# Altium project STM32G0_Test.PrjPcb
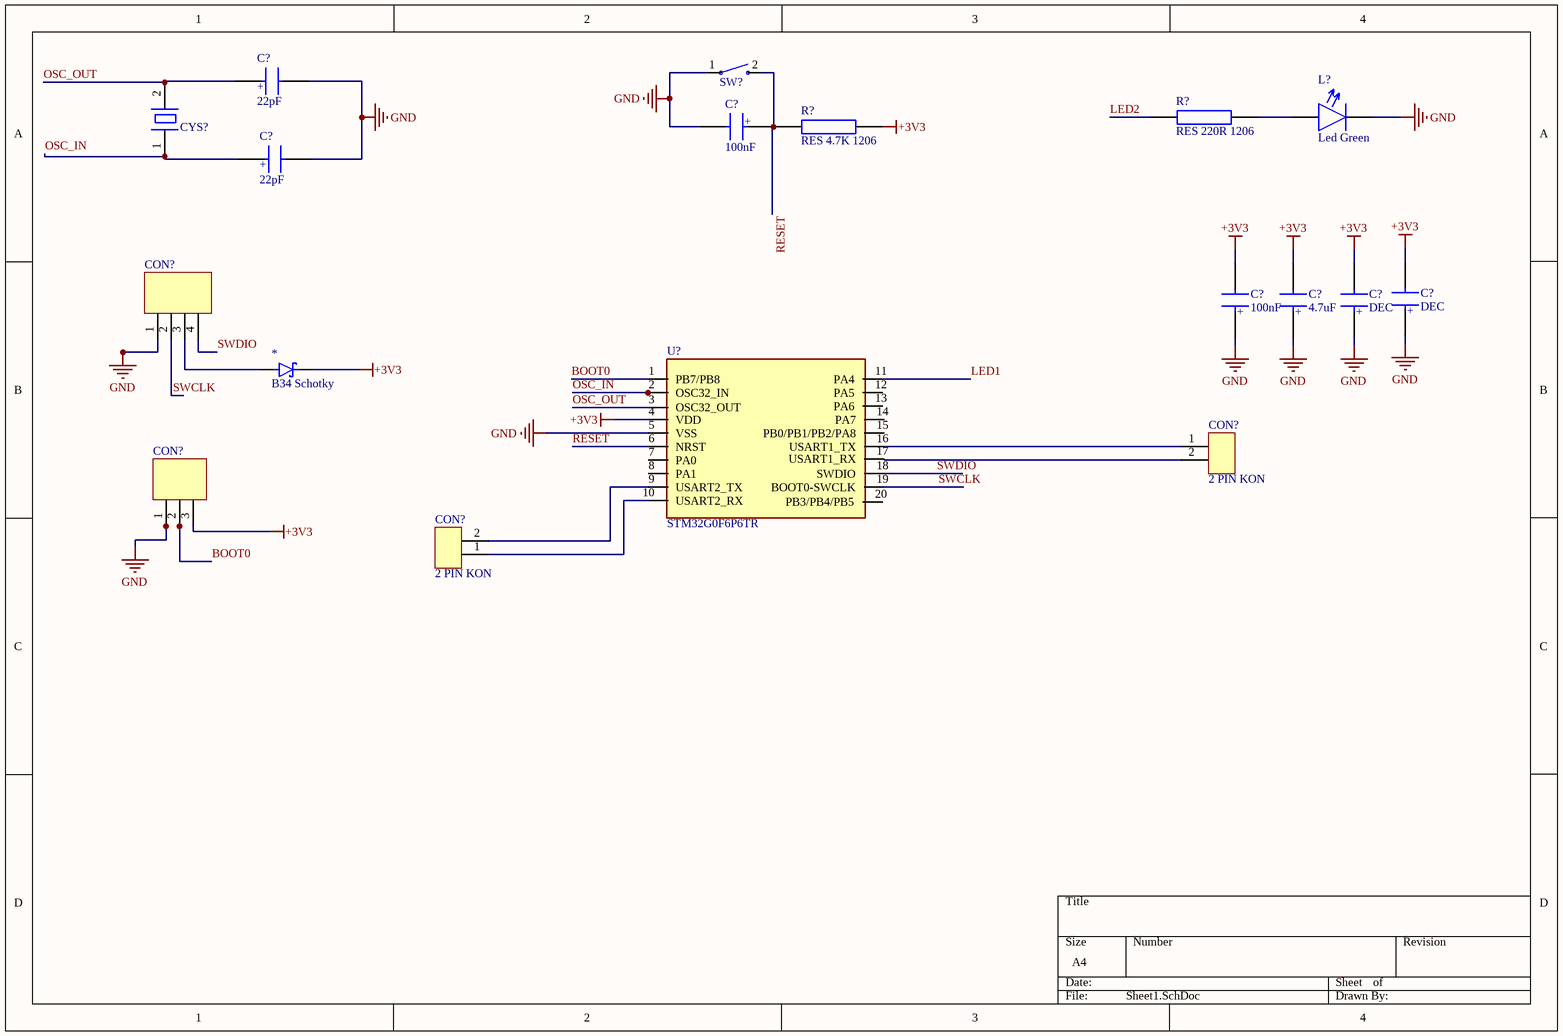
[diagram p0: Sheet1.SchDoc]
1 sheet, 18 parts. Net scope: global (net labels, ports and power ports of the same name join across sheets).
Board file: PCB2.PcbDoc

## Sheet Sheet1.SchDoc
size A4; SheetNumber: 1; SheetTotal: 1

### Parts
(Parts that share a designator on the sheet are numbered #1, #2 ... from top to bottom, then left to right.)
*  B34 Schotky  [DIOM5226X240N]
C?#1  22pF  [CAP_805]
C?#2  100nF  [CAP_805]
C?#3  22pF  [CAP_805]
C?#4  DEC  [CAP_805]
C?#5  100nF  [CAP_805]
C?#6  4.7uF  [CAP_805]
C?#7  DEC  [CAP_805]
CON?#1  4 PIN CON  [4 PIN 2.54MM]  (value not drawn)
CON?#2  2 PIN KON  [2 PIN 2.54MM]
CON?#3  3 PIN KON  [3pin 2.54mm]  (value not drawn)
CON?#4  2 PIN KON  [2 PIN 2.54MM]
CYS?  Kristal - HC-49Us  [Kristal - HC-49Us -smd]  (value not drawn)
L?  Led Green  [Led 1206]
R?#1  RES 220R 1206  [RES_1206]
R?#2  RES 4.7K 1206  [RES_1206]
SW?  1437566-3  [SW_1437566-3]  (value not drawn)
U?  STM32G0F6P6TR  [TSSOP-20]

### Nets
+3V3: *.C C?#4.2 C?#5.2 C?#6.2 C?#7.2 CON?#3.3 R?#2.2 U?.4(VDD)
GND: C?#1.2 C?#2.2 C?#3.2 C?#4.1 C?#5.1 C?#6.1 C?#7.1 CON?#1.1 CON?#3.1 L?.2 SW?.1 U?.5(VSS)
BOOT0: CON?#3.2 U?.1(PB7/PB8)
LED1: U?.11(PA4)
LED2: R?#1.1
OSC_IN: C?#3.1 CYS?.1 U?.2(OSC32_IN)
OSC_OUT: C?#1.1 CYS?.2 U?.3(OSC32_OUT)
RESET: C?#2.1 R?#2.1 SW?.2 U?.6(NRST)
SWCLK: CON?#1.2 U?.19(BOOT0-SWCLK)
SWDIO: CON?#1.4 U?.18(SWDIO)
Net*_A: *.A CON?#1.3
NetCON?#2_1: CON?#2.1 U?.16(USART1_TX)
NetCON?#2_2: CON?#2.2 U?.17(USART1_RX)
NetCON?#4_1: CON?#4.1 U?.10(USART2_RX)
NetCON?#4_2: CON?#4.2 U?.9(USART2_TX)
NetL?_1: L?.1 R?#1.2

Not connected (* = marked no-connect by the designer): U? 7(PA0) 8(PA1) 12(PA5) 13(PA6) 14(PA7) 15(PB0/PB1/PB2/PA8) 20(PB3/PB4/PB5)

### Notes on the sheet
- (in symbol CAP 22uf 0805) +

### Library data of the parts
C?#1-C?#7 = CAP 22uf 0805: 0805 smd
CON?#1 = 4 PIN CON: 2.54mm vertical connector
CON?#2 CON?#4 = 2 PIN KON: 2.54 mm vertical
CON?#3 = 3 PIN KON: 2.54mm vertical connector
CYS? = Kristal - HC-49Us: Smd tipi kristal
SW? = 1437566-3: Switch Tactile OFF (ON) SPST Rectangular Button Gull Wing 0.05A 12VDC SMD Loose Piece; Price: None; Value: *; Package: None; Availability: Unavailable; MP: 1437566-3